# Altium project sounderlocator.PrjPcb
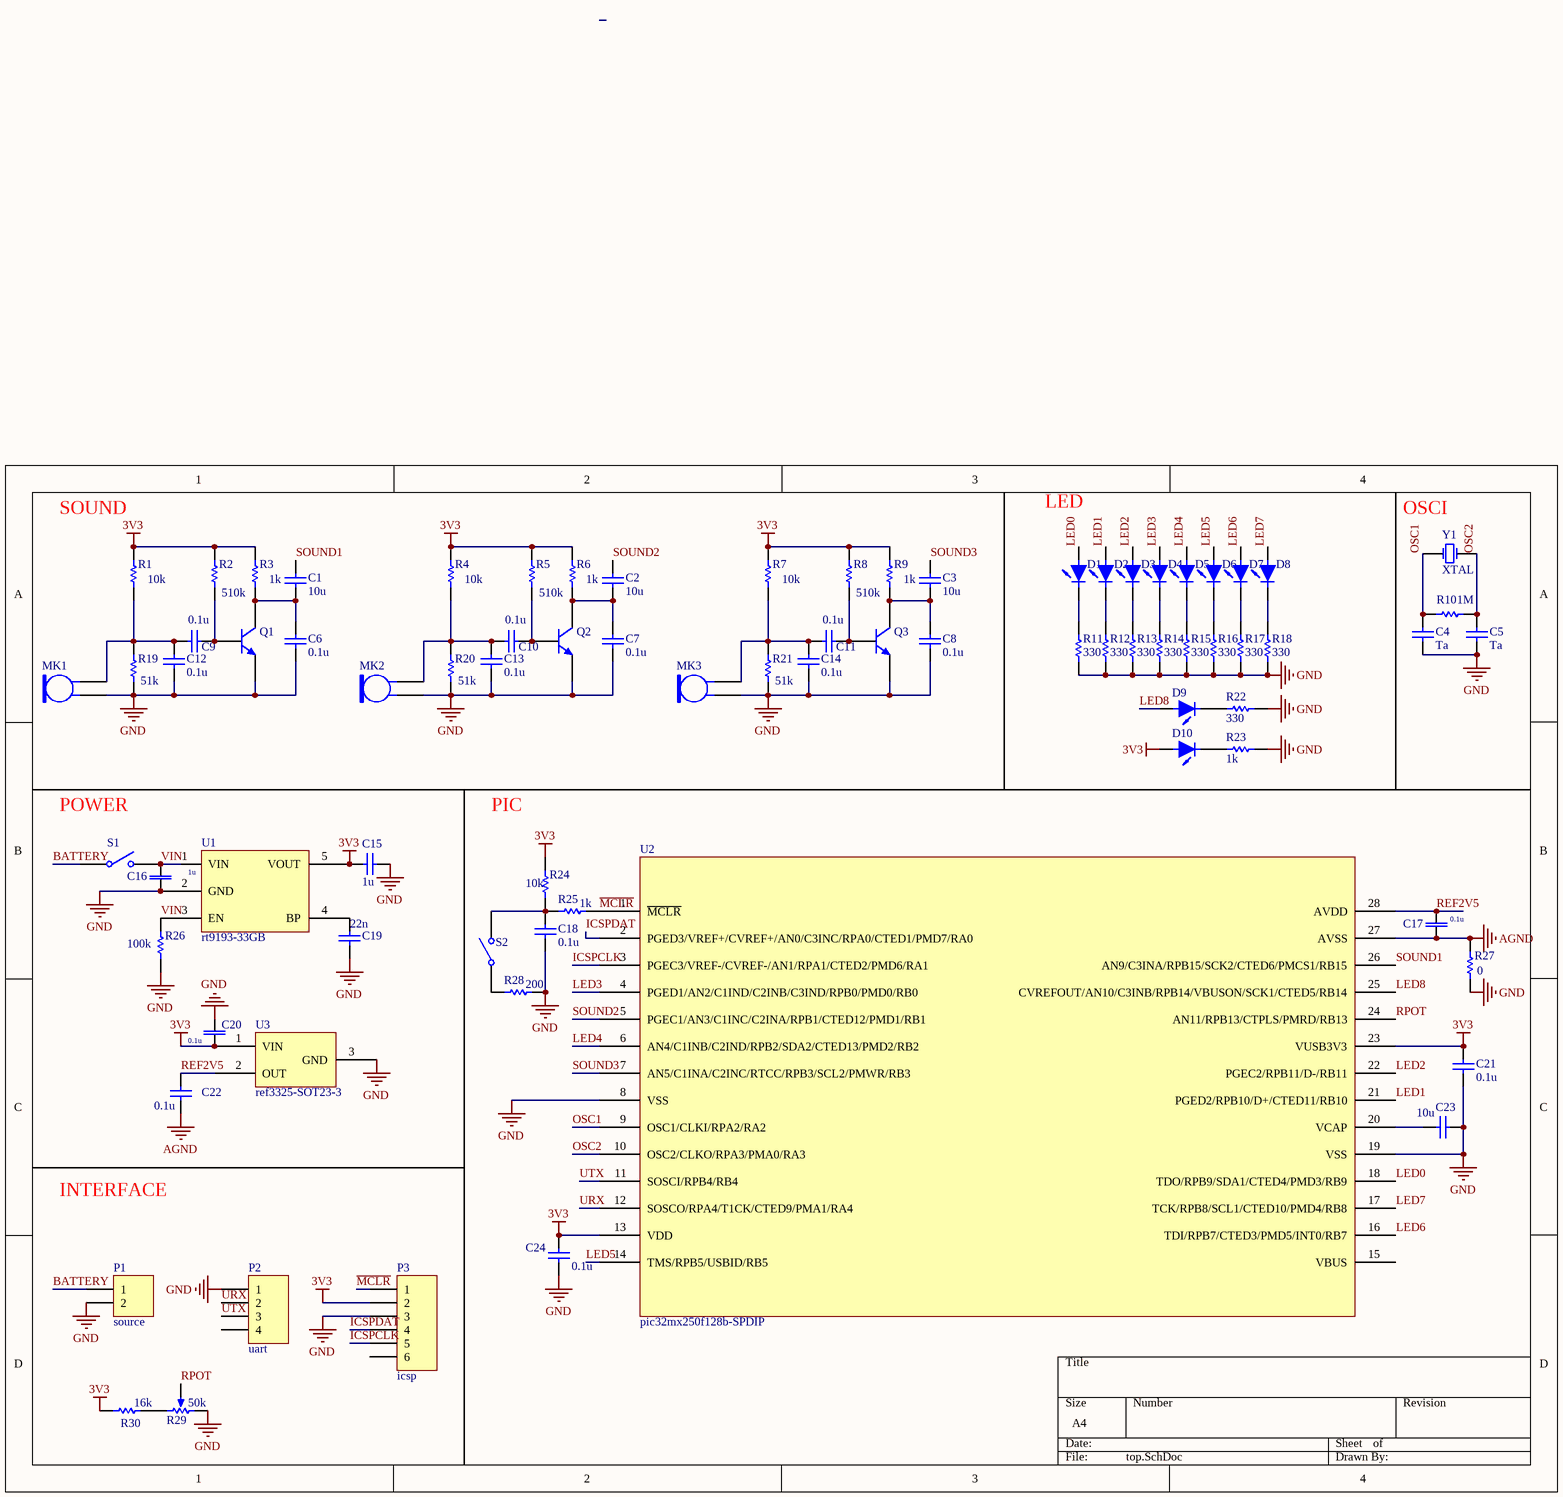
[diagram p0: top.SchDoc]
1 sheet, 79 parts. Net scope: global (net labels, ports and power ports of the same name join across sheets).
Board file: PCB1.PcbDoc

## Sheet top.SchDoc
size A4; PageSetup: Record=PageOptions|CenterHorizontal=True|CenterVertical=True|PrintScale=1.00|XCorrection=1.00|YCorrection=1.00|PrintKind=0|BorderSize=5000000|LeftOffset=0|BottomOffset=0|Orientation=2|PaperLength=1000|PaperWidth=1000|Scale=100|PaperSource=7|PrintQuality=-3|MediaType=1|DitherType=10|PrintScaleMode=1|PaperKind=A4|PaperIndex=9

### Parts
C1  value 10u  [CAPC1608N]  (hidden comment: Cap)
C2  value 10u  [CAPC1608N]  (hidden comment: Cap)
C3  value 10u  [CAPC1608N]  (hidden comment: Cap)
C4  Ta  [CAPC1608N]
C5  Ta  [CAPC1608N]
C6  value 0.1u  [CAPC1608N]  (hidden comment: Cap)
C7  value 0.1u  [CAPC1608N]  (hidden comment: Cap)
C8  value 0.1u  [CAPC1608N]  (hidden comment: Cap)
C9  value 0.1u  [CAPC1608N]  (hidden comment: Cap)
C10  value 0.1u  [CAPC1608N]  (hidden comment: Cap)
C11  value 0.1u  [CAPC1608N]  (hidden comment: Cap)
C12  value 0.1u  [CAPC1608N]  (hidden comment: Cap)
C13  value 0.1u  [CAPC1608N]  (hidden comment: Cap)
C14  value 0.1u  [CAPC1608N]  (hidden comment: Cap)
C15  value 1u  [CAPC1608N]  (hidden comment: Cap)
C16  value 1u  [CAPC1608N]  (hidden comment: Cap)
C17  value 0.1u  [CAPC1608N]  (hidden comment: Cap)
C18  value 0.1u  [CAPC1608N]  (hidden comment: Cap)
C19  value 22n  [CAPC1608N]  (hidden comment: Cap)
C20  value 0.1u  [CAPC1608N]  (hidden comment: Cap)
C21  value 0.1u  [CAPC1608N]  (hidden comment: Cap)
C22  value 0.1u  [CAPC1608N]  (hidden comment: Cap)
C23  value 10u  [CAPC1608N]  (hidden comment: Cap)
C24  value 0.1u  [CAPC1608N]  (hidden comment: Cap)
D1  LED2  [CD1608-0603]  (value not drawn)
D2  LED2  [CD1608-0603]  (value not drawn)
D3  LED2  [CD1608-0603]  (value not drawn)
D4  LED2  [CD1608-0603]  (value not drawn)
D5  LED2  [CD1608-0603]  (value not drawn)
D6  LED2  [CD1608-0603]  (value not drawn)
D7  LED2  [CD1608-0603]  (value not drawn)
D8  LED2  [CD1608-0603]  (value not drawn)
D9  LED2  [CD1608-0603]  (value not drawn)
D10  LED2  [CD1608-0603]  (value not drawn)
MK1  Mic2  [MK]  (value not drawn)
MK2  Mic2  [MK]  (value not drawn)
MK3  Mic2  [MK]  (value not drawn)
P1  source  [HDR1X2]
P2  uart  [HDR1X4]
P3  icsp  [HDR1X6]
Q1  QNPN  [SOT-23B_N]  (value not drawn)
Q2  QNPN  [SOT-23B_N]  (value not drawn)
Q3  QNPN  [SOT-23B_N]  (value not drawn)
R1  value 10k  [RESC1608N]  (hidden comment: Res1)
R2  value 510k  [RESC1608N]  (hidden comment: Res1)
R3  value 1k  [RESC1608N]  (hidden comment: Res1)
R4  value 10k  [RESC1608N]  (hidden comment: Res1)
R5  value 510k  [RESC1608N]  (hidden comment: Res1)
R6  value 1k  [RESC1608N]  (hidden comment: Res1)
R7  value 10k  [RESC1608N]  (hidden comment: Res1)
R8  value 510k  [RESC1608N]  (hidden comment: Res1)
R9  value 1k  [RESC1608N]  (hidden comment: Res1)
R10  value 1M  [RESC1608N]  (hidden comment: Res1)
R11  value 330  [RESC1608N]  (hidden comment: Res1)
R12  value 330  [RESC1608N]  (hidden comment: Res1)
R13  value 330  [RESC1608N]  (hidden comment: Res1)
R14  value 330  [RESC1608N]  (hidden comment: Res1)
R15  value 330  [RESC1608N]  (hidden comment: Res1)
R16  value 330  [RESC1608N]  (hidden comment: Res1)
R17  value 330  [RESC1608N]  (hidden comment: Res1)
R18  value 330  [RESC1608N]  (hidden comment: Res1)
R19  value 51k  [RESC1608N]  (hidden comment: Res1)
R20  value 51k  [RESC1608N]  (hidden comment: Res1)
R21  value 51k  [RESC1608N]  (hidden comment: Res1)
R22  value 330  [RESC1608N]  (hidden comment: Res1)
R23  value 1k  [RESC1608N]  (hidden comment: Res1)
R24  value 10k  [RESC1608N]  (hidden comment: Res1)
R25  value 1k  [RESC1608N]  (hidden comment: Res1)
R26  value 100k  [RESC1608N]  (hidden comment: Res1)
R27  value 0  [RESC1608N]  (hidden comment: Res1)
R28  value 200  [RESC1608N]  (hidden comment: Res1)
R29  value 50k  [RPOT]  (hidden comment: RPot)
R30  value 16k  [RESC1608N]  (hidden comment: Res1)
S1  SW-SPST  [PIN3]  (value not drawn)
S2  SW-SPST  [sw]  (value not drawn)
U1  rt9193-33GB  [SOT23-5_N]
U2  pic32mx250f128b-SPDIP  [DIP-28]
U3  ref3325-SOT23-3  [SOT23-3]
Y1  XTAL  [XTAL]

### Nets
3V3: C15.2 C20.2 C21.1 C24.1 D10.1(A) P3.2 R1.2 R2.1 R3.1 R4.2 R5.1 R6.1 R7.2 R8.1 R9.1 R24.2 R30.2 U1.5(VOUT) U2.13(VDD) U2.23(VUSB3V3) U3.1(VIN)
AGND: C17.2 C22.1 R27.1 U2.27(AVSS)
GND: C4.2 C5.2 C6.2 C7.2 C8.2 C12.2 C13.2 C14.2 C15.1 C16.2 C18.2 C19.1 C20.1 C21.2 C23.1 C24.2 MK1.1 MK2.1 MK3.1 P1.2 P2.1 P3.3 Q1.3(E) Q2.3(E) Q3.3(E) R11.1 R12.1 R13.1 R14.1 R15.1 R16.1 R17.1 R18.1 R19.2 R20.2 R21.2 R22.1 R23.1 R26.1 R27.2 R28.1 R29.1(TOP) U1.2(GND) U2.8(VSS) U2.19(VSS) U3.3(GND)
BATTERY: P1.1 S1.1(COMMON)
ICSPCLK: P3.5 U2.3(PGEC3/VREF-/CVREF-/AN1/RPA1/CTED2/PMD6/RA1)
ICSPDAT: P3.4 U2.2(PGED3/VREF+/CVREF+/AN0/C3INC/RPA0/CTED1/PMD7/RA0)
LED0: D1.1(A) U2.18(TDO/RPB9/SDA1/CTED4/PMD3/RB9)
LED1: D2.1(A) U2.21(PGED2/RPB10/D+/CTED11/RB10)
LED2: D3.1(A) U2.22(PGEC2/RPB11/D-/RB11)
LED3: D4.1(A) U2.4(PGED1/AN2/C1IND/C2INB/C3IND/RPB0/PMD0/RB0)
LED4: D5.1(A) U2.6(AN4/C1INB/C2IND/RPB2/SDA2/CTED13/PMD2/RB2)
LED5: D6.1(A) U2.14(TMS/RPB5/USBID/RB5)
LED6: D7.1(A) U2.16(TDI/RPB7/CTED3/PMD5/INT0/RB7)
LED7: D8.1(A) U2.17(TCK/RPB8/SCL1/CTED10/PMD4/RB8)
LED8: D9.1(A) U2.25(CVREFOUT/AN10/C3INB/RPB14/VBUSON/SCK1/CTED5/RB14)
~{MCLR}: P3.1 R25.1 U2.1(~{MCLR})
OSC1: C4.1 R10.1 U2.9(OSC1/CLKI/RPA2/RA2) Y1.2(OSC2)
OSC2: C5.1 R10.2 U2.10(OSC2/CLKO/RPA3/PMA0/RA3) Y1.1(OSC1)
REF2V5: C17.1 C22.2 U2.28(AVDD) U3.2(OUT)
RPOT: R29.3(TAP) U2.24(AN11/RPB13/CTPLS/PMRD/RB13)
SOUND1: C1.2 U2.26(AN9/C3INA/RPB15/SCK2/CTED6/PMCS1/RB15)
SOUND2: C2.2 U2.5(PGEC1/AN3/C1INC/C2INA/RPB1/CTED12/PMD1/RB1)
SOUND3: C3.2 U2.7(AN5/C1INA/C2INC/RTCC/RPB3/SCL2/PMWR/RB3)
URX: P2.2 U2.12(SOSCO/RPA4/T1CK/CTED9/PMA1/RA4)
UTX: P2.3 U2.11(SOSCI/RPB4/RB4)
VIN: C16.1 R26.2 S1.2(NO) U1.1(VIN) U1.3(EN)
NetC1_1: C1.1 C6.1 Q1.1(C) R3.2
NetC2_1: C2.1 C7.1 Q2.1(C) R6.2
NetC3_1: C3.1 C8.1 Q3.1(C) R9.2
NetC9_1: C9.1 C12.1 MK1.2 R1.1 R19.1
NetC9_2: C9.2 Q1.2(B) R2.2
NetC10_1: C10.1 C13.1 MK2.2 R4.1 R20.1
NetC10_2: C10.2 Q2.2(B) R5.2
NetC11_1: C11.1 C14.1 MK3.2 R7.1 R21.1
NetC11_2: C11.2 Q3.2(B) R8.2
NetC18_1: C18.1 R24.1 R25.2 S2.2(NO)
NetC19_2: C19.2 U1.4(BP)
NetC23_2: C23.2 U2.20(VCAP)
NetD1_2: D1.2(K) R11.2
NetD2_2: D2.2(K) R12.2
NetD3_2: D3.2(K) R13.2
NetD4_2: D4.2(K) R14.2
NetD5_2: D5.2(K) R15.2
NetD6_2: D6.2(K) R16.2
NetD7_2: D7.2(K) R17.2
NetD8_2: D8.2(K) R18.2
NetD9_2: D9.2(K) R22.2
NetD10_2: D10.2(K) R23.2
NetR28_2: R28.2 S2.1(COMMON)
NetR29_2: R29.2(BOT) R30.1

Not connected (* = marked no-connect by the designer): P2 4; P3 6; U2 15(VBUS)

### Notes on the sheet
- (near R1) SOUND
- LED
- (near Y1) OSCI
- (near S1) POWER
- PIC
- INTERFACE

### Library data of the parts
C1-C3 C6-C24 = Cap: Capacitor; Published: 8-Jun-2000; LatestRevisionDate: 17-Jul-2002; LatestRevisionNote: Re-released for DXP Platform.; PackageReference: RAD-0.3; Publisher: Altium Limited
  C1-C3 C6-C15 C18 C19 C21-C24: PackageDescription: Radial Cap, Thru-Hole; 2 Leads; 0.3 in Pin Spacing
C4 C5 = Cap: Capacitor; Value: 100pF; Published: 8-Jun-2000; LatestRevisionDate: 17-Jul-2002; LatestRevisionNote: Re-released for DXP Platform.; PackageReference: RAD-0.3; Publisher: Altium Limited; PackageDescription: Radial Cap, Thru-Hole; 2 Leads; 0.3 in Pin Spacing
D1-D10 = LED2: Typical RED, GREEN, YELLOW, AMBER GaAs LED; Published: 8-Jun-2000; LatestRevisionDate: 17-Jul-2002; LatestRevisionNote: Re-released for DXP Platform.; PackageVersion: Feb-2002; PackageReference: 3.2X1.6X1.1; Publisher: Altium Limited
MK1-MK3 = Mic2: Microphone; Published: 24-Mar-1999; LatestRevisionDate: 17-Jul-2002; LatestRevisionNote: Re-released for DXP Platform.; PackageReference: PIN2; Publisher: Altium Limited
P1 = Header 2: Header, 2-Pin; LatestRevisionDate: 17-Jul-2002; LatestRevisionNote: Re-released for DXP Platform.; Publisher: Altium Limited
P2 = Header 4: Header, 4-Pin; LatestRevisionDate: 17-Jul-2002; LatestRevisionNote: Re-released for DXP Platform.; Publisher: Altium Limited
P3 = Header 6: Header, 6-Pin; LatestRevisionDate: 17-Jul-2002; LatestRevisionNote: Re-released for DXP Platform.; Publisher: Altium Limited
Q1-Q3 = QNPN: NPN Bipolar Transistor; pin to pad: 1>3 2>1 3>2; Published: 8-Jun-2000; LatestRevisionDate: 29-May-2009; LatestRevisionNote: IPC-7351 Footprint Added.; PackageVersion: Aug-1999; PackageReference: SOT-23B; Publisher: Altium Limited; PackageDescription: 3-Pin SOT-23 Package 0.95 mm Pitch, 2.4 mm Lead Span
R1-R28 R30 = Res1: Resistor; Published: 8-Jun-2000; LatestRevisionDate: 17-Jul-2002; LatestRevisionNote: Re-released for DXP Platform.; PackageReference: AXIAL-0.3; Publisher: Altium Limited; PackageDescription: Axial Device, Thru-Hole; 2 Leads; 0.3 in Pin Spacing
R29 = RPot: Potentiometer; pin to pad: 2>3 3>2; Sim Note: Enter the Resistance value and the set point into parameter fields.; Set Position: 0.5; Published: 8-Jun-2000; LatestRevisionDate: 17-Jul-2002; LatestRevisionNote: Re-released for DXP Platform.; PackageReference: VR5; Publisher: Altium Limited; PackageDescription: Variable Resistor, Thru-Hole; 3 Leads
S1 = SW-SPST: Single-Pole, Single-Throw Switch; pin to pad: 1>3; Published: 24-Mar-1999; LatestRevisionDate: 17-Jul-2002; LatestRevisionNote: Re-released for DXP Platform.; PackageReference: SPST-2; Publisher: Altium Limited; PackageDescription: Switch; 2 Leads
S2 = SW-SPST: Single-Pole, Single-Throw Switch; Published: 24-Mar-1999; LatestRevisionDate: 17-Jul-2002; LatestRevisionNote: Re-released for DXP Platform.; PackageReference: SPST-2; Publisher: Altium Limited; PackageDescription: Switch; 2 Leads
U1 = rt9193
U2 = pic32mx250f128b
U3 = ref33xx
Y1 = XTAL: Crystal Oscillator; Published: 8-Jun-2000; LatestRevisionDate: 17-Jul-2002; LatestRevisionNote: Re-released for DXP Platform.; PackageReference: R38; Publisher: Altium Limited